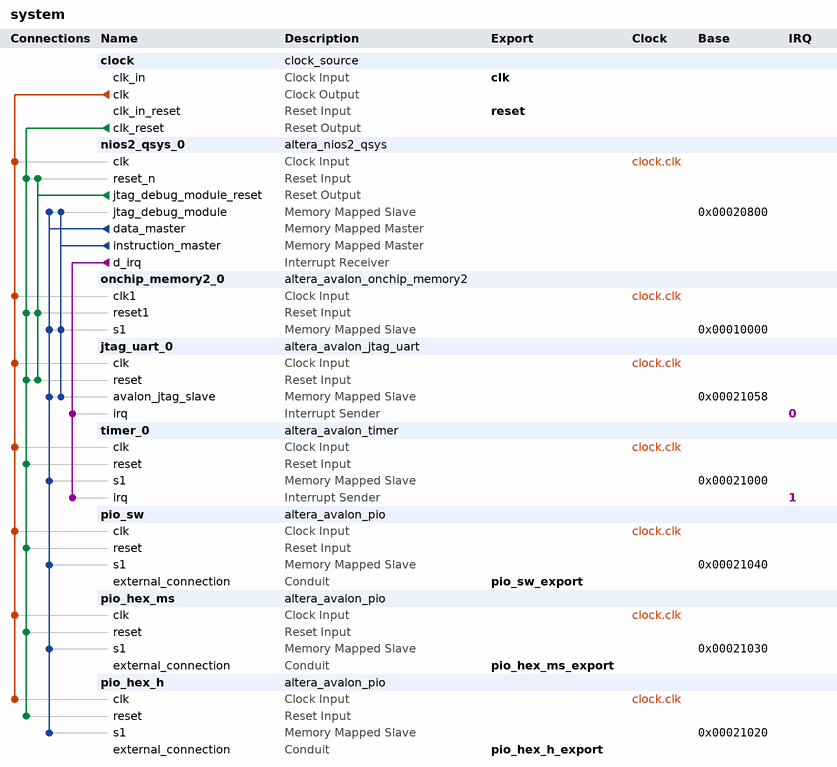
[diagram p0: system contents]
# Platform Designer (Qsys) system system, Cyclone II EP2C35F672C6
# Parameters at their usual value, and those the tool derives, are not listed.
package require -exact qsys 13.0.1.99.2
create_system system
set_project_property DEVICE_FAMILY {Cyclone II}
set_project_property DEVICE EP2C35F672C6

add_instance clock clock_source 13.0
set_instance_parameter_value clock clockFrequency 50000000

add_instance nios2_qsys_0 altera_nios2_qsys 13.0
set_instance_parameter_value nios2_qsys_0 resetSlave onchip_memory2_0.s1
set_instance_parameter_value nios2_qsys_0 mmu_TLBMissExcSlave None
set_instance_parameter_value nios2_qsys_0 exceptionSlave onchip_memory2_0.s1
set_instance_parameter_value nios2_qsys_0 breakSlave nios2_qsys_0.jtag_debug_module
set_instance_parameter_value nios2_qsys_0 impl Tiny
set_instance_parameter_value nios2_qsys_0 icache_size 4096

add_instance onchip_memory2_0 altera_avalon_onchip_memory2 13.0.1.99.2
set_instance_parameter_value onchip_memory2_0 dataWidth 32
set_instance_parameter_value onchip_memory2_0 dualPort false
set_instance_parameter_value onchip_memory2_0 initMemContent true
set_instance_parameter_value onchip_memory2_0 initializationFileName onchip_mem.hex
set_instance_parameter_value onchip_memory2_0 memorySize 40960

add_instance jtag_uart_0 altera_avalon_jtag_uart 13.0.1.99.2
set_instance_parameter_value jtag_uart_0 simInteractiveOptions NO_INTERACTIVE_WINDOWS

add_instance timer_0 altera_avalon_timer 13.0.1.99.2
set_instance_parameter_value timer_0 period 1
set_instance_parameter_value timer_0 periodUnits MSEC

add_instance pio_sw altera_avalon_pio 13.0.1.99.2
set_instance_parameter_value pio_sw direction Input
set_instance_parameter_value pio_sw width 6

add_instance pio_hex_ms altera_avalon_pio 13.0.1.99.2
set_instance_parameter_value pio_hex_ms direction Output
set_instance_parameter_value pio_hex_ms width 32

add_instance pio_hex_h altera_avalon_pio 13.0.1.99.2
set_instance_parameter_value pio_hex_h direction Output
set_instance_parameter_value pio_hex_h width 16

# connections
add_connection clock.clk jtag_uart_0.clk clock
add_connection clock.clk nios2_qsys_0.clk clock
add_connection clock.clk onchip_memory2_0.clk1 clock
add_connection clock.clk pio_hex_h.clk clock
add_connection clock.clk pio_hex_ms.clk clock
add_connection clock.clk pio_sw.clk clock
add_connection clock.clk timer_0.clk clock
add_connection clock.clk_reset jtag_uart_0.reset reset
add_connection clock.clk_reset nios2_qsys_0.reset_n reset
add_connection clock.clk_reset onchip_memory2_0.reset1 reset
add_connection clock.clk_reset pio_hex_h.reset reset
add_connection clock.clk_reset pio_hex_ms.reset reset
add_connection clock.clk_reset pio_sw.reset reset
add_connection clock.clk_reset timer_0.reset reset
add_connection nios2_qsys_0.jtag_debug_module_reset jtag_uart_0.reset reset
add_connection nios2_qsys_0.jtag_debug_module_reset nios2_qsys_0.reset_n reset
add_connection nios2_qsys_0.jtag_debug_module_reset onchip_memory2_0.reset1 reset
add_connection nios2_qsys_0.data_master jtag_uart_0.avalon_jtag_slave avalon
set_connection_parameter_value nios2_qsys_0.data_master/jtag_uart_0.avalon_jtag_slave baseAddress 0x00021058
add_connection nios2_qsys_0.data_master nios2_qsys_0.jtag_debug_module avalon
set_connection_parameter_value nios2_qsys_0.data_master/nios2_qsys_0.jtag_debug_module baseAddress 0x00020800
add_connection nios2_qsys_0.data_master onchip_memory2_0.s1 avalon
set_connection_parameter_value nios2_qsys_0.data_master/onchip_memory2_0.s1 baseAddress 0x00010000
add_connection nios2_qsys_0.data_master pio_hex_h.s1 avalon
set_connection_parameter_value nios2_qsys_0.data_master/pio_hex_h.s1 baseAddress 0x00021020
add_connection nios2_qsys_0.data_master pio_hex_ms.s1 avalon
set_connection_parameter_value nios2_qsys_0.data_master/pio_hex_ms.s1 baseAddress 0x00021030
add_connection nios2_qsys_0.data_master pio_sw.s1 avalon
set_connection_parameter_value nios2_qsys_0.data_master/pio_sw.s1 baseAddress 0x00021040
add_connection nios2_qsys_0.data_master timer_0.s1 avalon
set_connection_parameter_value nios2_qsys_0.data_master/timer_0.s1 baseAddress 0x00021000
add_connection nios2_qsys_0.instruction_master jtag_uart_0.avalon_jtag_slave avalon
set_connection_parameter_value nios2_qsys_0.instruction_master/jtag_uart_0.avalon_jtag_slave baseAddress 0x00021058
add_connection nios2_qsys_0.instruction_master nios2_qsys_0.jtag_debug_module avalon
set_connection_parameter_value nios2_qsys_0.instruction_master/nios2_qsys_0.jtag_debug_module baseAddress 0x00020800
add_connection nios2_qsys_0.instruction_master onchip_memory2_0.s1 avalon
set_connection_parameter_value nios2_qsys_0.instruction_master/onchip_memory2_0.s1 baseAddress 0x00010000
add_connection nios2_qsys_0.d_irq jtag_uart_0.irq interrupt
set_connection_parameter_value nios2_qsys_0.d_irq/jtag_uart_0.irq irqNumber 0
add_connection nios2_qsys_0.d_irq timer_0.irq interrupt
set_connection_parameter_value nios2_qsys_0.d_irq/timer_0.irq irqNumber 1

# exported interfaces
add_interface clk clock sink
set_interface_property clk EXPORT_OF clock.clk_in
add_interface reset reset sink
set_interface_property reset EXPORT_OF clock.clk_in_reset
add_interface pio_sw_export conduit end
set_interface_property pio_sw_export EXPORT_OF pio_sw.external_connection
add_interface pio_hex_ms_export conduit end
set_interface_property pio_hex_ms_export EXPORT_OF pio_hex_ms.external_connection
add_interface pio_hex_h_export conduit end
set_interface_property pio_hex_h_export EXPORT_OF pio_hex_h.external_connection

set_interconnect_requirement {$system} qsys_mm.clockCrossingAdapter HANDSHAKE
set_interconnect_requirement {$system} qsys_mm.maxAdditionalLatency 1

save_system system.qsys
